# Altium schematic sheet FCC Footprint Charge Controller.SchDoc
size 513 x 386 mm; SheetNumber: 7; SheetTotal: 7
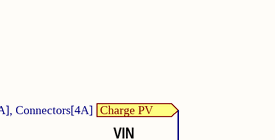
[diagram p0: FCC Footprint Charge Controller.SchDoc, top left]
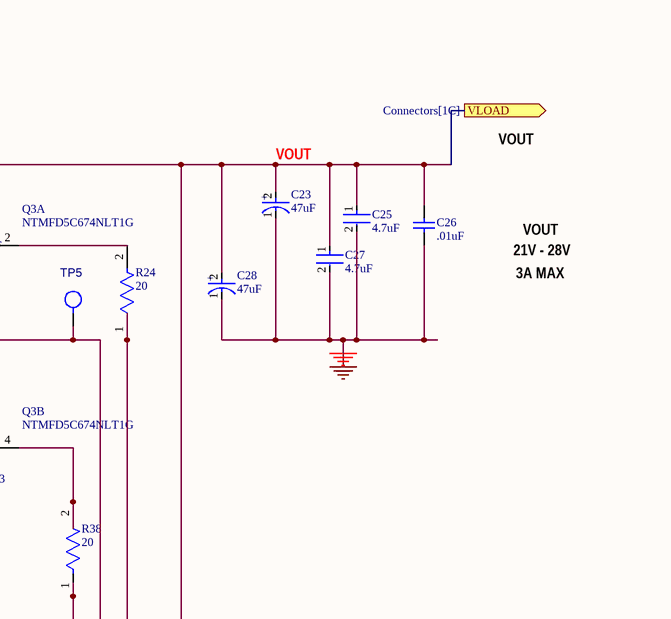
[diagram p1: FCC Footprint Charge Controller.SchDoc, top right]
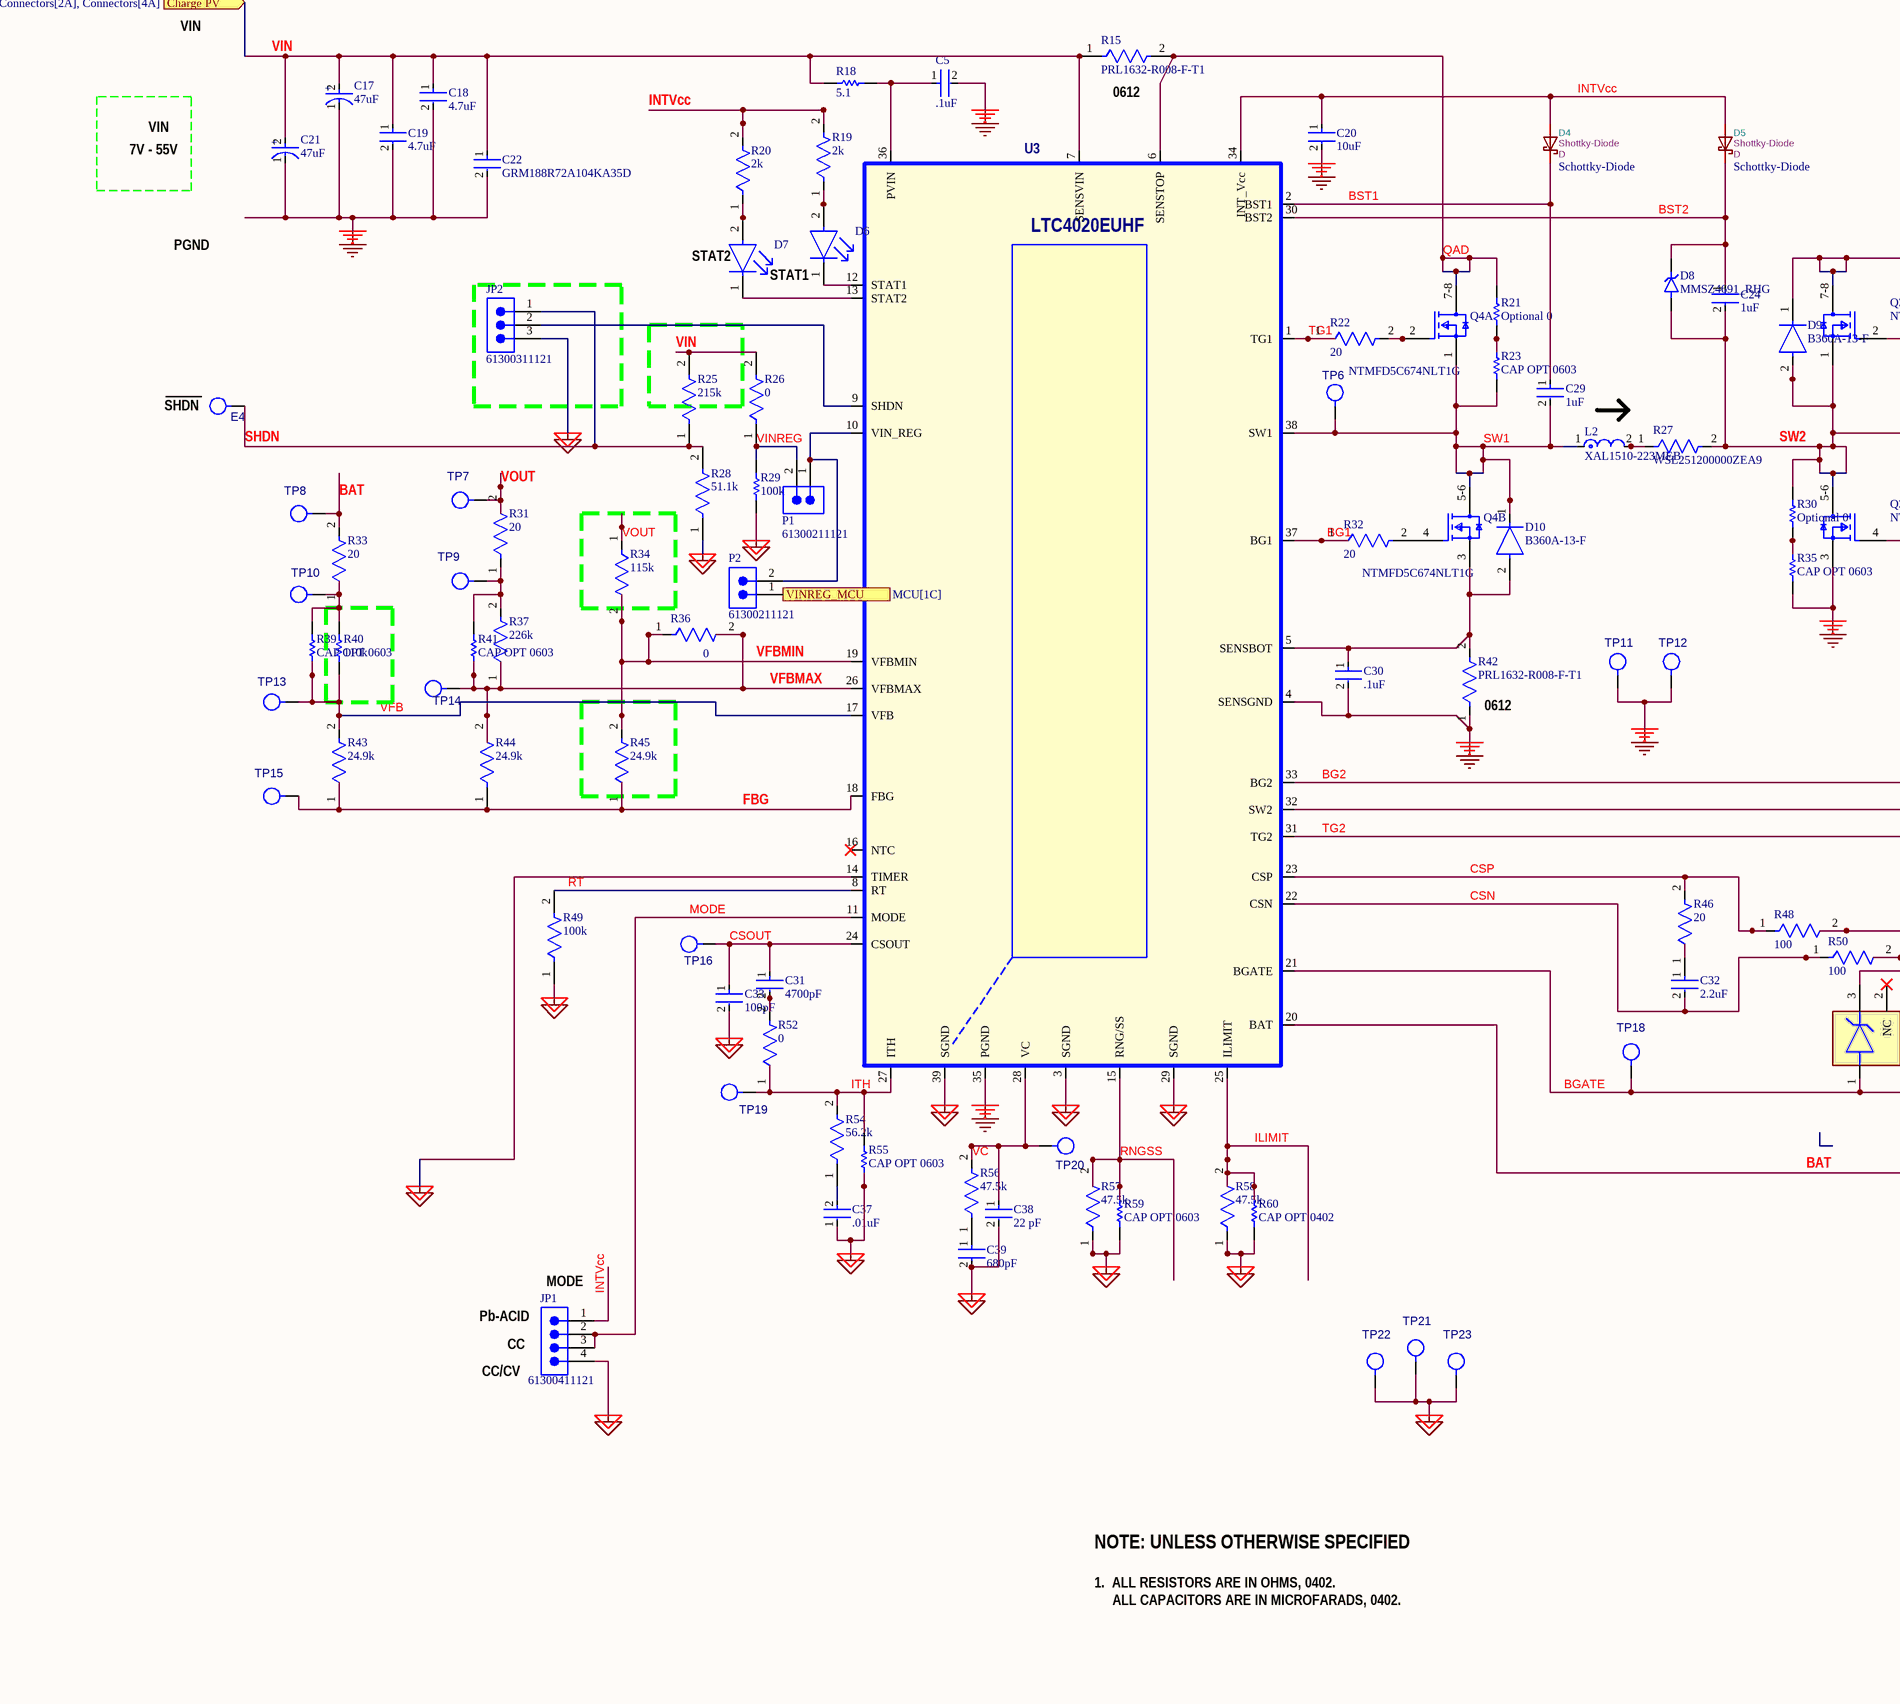
[diagram p2: FCC Footprint Charge Controller.SchDoc, bottom left]
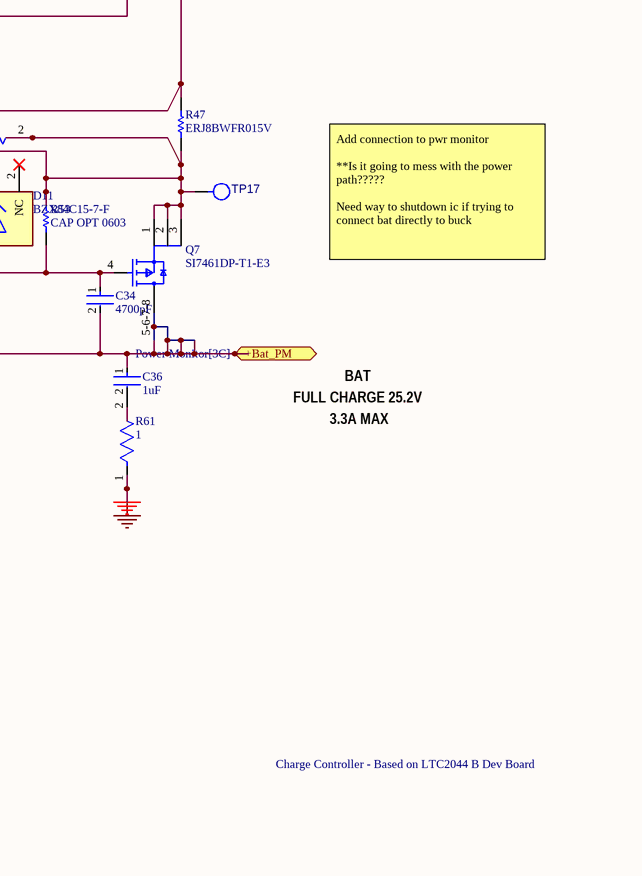
[diagram p3: FCC Footprint Charge Controller.SchDoc, bottom right]

## Parts
C5  .1uF  [FP-GRM188-0_1-e0_2_0_5-IPC_A]
C17  47uF  [FP-FKF-MFG]
C18  4.7uF  [FP-CGA6P-IPC_C]
C19  4.7uF  [FP-CGA6P-IPC_C]
C20  10uF  [FP-CGA4J-IPC_A]
C21  47uF  [FP-FKF-MFG]
C22  GRM188R72A104KA35D  [FP-GRM188-0_1-e0_2_0_5-IPC_B]
C23  47uF  [FP-FKF-MFG]
C24  1uF  [FP-C0603C-CJ-MFG]
C25  4.7uF  [FP-CGA6P-IPC_C]
C26  .01uF  [CAPC1608X92X38NL15T08]
C27  4.7uF  [FP-CGA6P-IPC_C]
C28  47uF  [FP-FKF-MFG]
C29  1uF  [FP-C0603C-CJ-MFG]
C30  .1uF  [FP-GCM155-0_05-IPC_A]
C31  4700pF  [FP-GRM155-0_05-IPC_B]
C32  2.2uF  [FP-GRM188-0_1-e0_2_0_5-IPC_A]
C33  100pF  [FP-C0402-BB-MFG]
C34  4700pF  [FP-GRM155-0_05-IPC_B]
C36  1uF  [FP-GCJ31C-0_3-IPC_A]
C37  .01uF  [FP-GCJ188-0_2-IPC_A]
C38  22 pF  [FP-C0603C-CF-MFG]
C39  680pF  [FP-C0603C-CF-MFG]
D4  Schottky-Diode  value Shottky-Diode  Reference: D  [SOD-123]
D5  Schottky-Diode  value Shottky-Diode  Reference: D  [SOD-123]
D6  (no value)  [FP-APT1608MGC-MFG]
D7  (no value)  [FP-APTD1608SURCK-MFG]
D8  MMSZ4691_RHG  [DIO_MMSZ4691_RHG]
D9  B360A-13-F  [FP-SMA-MFG]
D10  B360A-13-F  [FP-SMA-MFG]
D11  BZX84C15-7-F  [FP-SOT23-MFG]
E4  TEST POINT  [MILLMAX2308]  (value not drawn)
JP1  61300411121  [61300411121]
JP2  61300311121  [61300311121]
L2  XAL1510-223MEB  [FP-XAL1510-223MEB-MFG]
P1  61300211121  [61300211121]
P2  61300211121  [61300211121]
Q3  NTMFD5C674NLT1G  [FP-506BT-MFG]  (parts A,B of 2)
Q4  NTMFD5C674NLT1G  [FP-506BT-MFG]  (parts A,B of 2)
Q7  SI7461DP-T1-E3  [FP-S17-0173-SINGLE-MFG]
R15  PRL1632-R008-F-T1  [FP-PRL1632-MFG]
R18  5.1  [RESC2013X50X30LL20T20]
R19  2k  [FP-CRCW0402-e3-IPC_A]
R20  2k  [FP-CRCW0402-e3-IPC_A]
R21  Optional 0  [RESC2013X50X30LL20T20]
R22  20  [FP-CRCW0402-C-e3-MFG]
R23  CAP OPT 0603  [RESC1608X55X25ML10T15]
R24  20  [FP-CRCW0402-C-e3-MFG]
R25  215k  [FP-CRCW0402-e3-MFG]
R26  0  [FP-RC0402-0_4-MFG]
R27  WSL251200000ZEA9  [FP-WSL2512-MFG]
R28  51.1k  [FP-RC_L0402-MFG]
R29  100k  [RESC1005X40X25NL10T10]
R30  Optional 0  [RESC2013X50X30LL20T20]
R31  20  [FP-AC0603-MFG]
R32  20  [FP-CRCW0402-C-e3-MFG]
R33  20  [FP-AC0603-MFG]
R34  115k  [FP-RC1608-IPC_A]
R35  CAP OPT 0603  [RESC1608X55X25ML10T15]
R36  0  [FP-CRCW0402-e3-IPC_C]
R37  226k  [FP-CRCW0603-e3-IPC_C]
R38  20  [FP-CRCW0402-C-e3-MFG]
R39  CAP OPT 0603  [RESC1608X55X25ML10T15]
R40  110k  [RESC1608X55X30NL20T20]
R41  CAP OPT 0603  [RESC1608X55X25ML10T15]
R42  PRL1632-R008-F-T1  [FP-PRL1632-MFG]
R43  24.9k  [FP-CRCW0603-e3-IPC_B]
R44  24.9k  [FP-CRCW0603-e3-IPC_B]
R45  24.9k  [FP-CRCW0603-e3-IPC_B]
R46  20  [FP-CRCW0402-C-e3-MFG]
R47  ERJ8BWFR015V  [RESC3216X70X50NL05T20]
R48  100  [FP-RT0402-0_35-IPC_C]
R49  100k  [FP-RT0402-MFG]
R50  100  [FP-RT0402-0_35-IPC_C]
R52  0  [FP-CRCW0402-e3-IPC_C]
R53  CAP OPT 0603  [RESC1608X55X25ML10T15]
R54  56.2k  [FP-CR0603-IPC_C]
R55  CAP OPT 0603  [RESC1608X55X25ML10T15]
R56  47.5k  [FP-RMCF0603-IPC_C]
R57  47.5k  [FP-RMCF0603-IPC_C]
R58  47.5k  [FP-RMCF0603-IPC_C]
R59  CAP OPT 0603  [RESC1608X55X25ML10T15]
R60  CAP OPT 0402  [RESC1005X40X25LL05T05]
R61  1  [FP-CRCW0805-e3-IPC_A]
TP5  TEST PAD  [PADSTYLE1]  (value not drawn)
TP6  TEST PAD  [PADSTYLE1]  (value not drawn)
TP7  TEST PAD  [PADSTYLE1]  (value not drawn)
TP8  TEST PAD  [PADSTYLE1]  (value not drawn)
TP9  TEST PAD  [PADSTYLE1]  (value not drawn)
TP10  TEST PAD  [PADSTYLE1]  (value not drawn)
TP11  TEST PAD  [PADSTYLE1]  (value not drawn)
TP12  TEST PAD  [PADSTYLE1]  (value not drawn)
TP13  TEST PAD  [PADSTYLE1]  (value not drawn)
TP14  TEST PAD  [PADSTYLE1]  (value not drawn)
TP15  TEST PAD  [PADSTYLE1]  (value not drawn)
TP16  TEST PAD  [PADSTYLE1]  (value not drawn)
TP17  TEST PAD  [PADSTYLE1]  (value not drawn)
TP18  TEST PAD  [PADSTYLE1]  (value not drawn)
TP19  TEST PAD  [PADSTYLE1]  (value not drawn)
TP20  TEST PAD  [PADSTYLE1]  (value not drawn)
TP21  TEST PAD  [PADSTYLE1]  (value not drawn)
TP22  TEST PAD  [PADSTYLE1]  (value not drawn)
TP23  TEST PAD  [PADSTYLE1]  (value not drawn)
U3  LTC4020EUHF  [FP-UHF-38-05-08-1701-IPC_A]

## Ports
+Bat_PM (bidir, see Power Monitor[3C]), Charge PV (in, see Connectors[1D], Connectors[2A], Connectors[4A]), VINREG_MCU (in, see MCU[1C]), VLOAD (out, see Connectors[1C])

## Nets
GND: C5.2 C17.1(C) C18.2 C19.2 C20.2 C21.1(C) C22.2 C23.1(C) C25.2 C26.1 C27.2 C28.1(C) C30.2 Q3.3(S2) R35.1 R42.1 R61.1 TP11.1 TP12.1 U3.4(SENSGND) U3.35(PGND)
GND_SIGNAL: C33.2 C37.1 C38.2 C39.2 JP1.4 JP2.3 R28.1 R29.2 R49.1 R55.1 R57.1 R58.1 R59.1 R60.1 TP21.1 TP22.1 TP23.1 U3.3(SGND) U3.14(TIMER) U3.29(SGND) U3.39(SGND)
BAT: C34.2 C36.1 Q7.5-6-7-8(D) R33.2 TP8.1 U3.20(BAT) ; port +Bat_PM
BG1: R32.1 U3.37(BG1)
BG2: R38.1 U3.33(BG2)
BGATE: C34.1 D11.1(A) Q7.4(G) R53.1 TP18.1 U3.21(BGATE)
BST1: C29.1 D4.K U3.2(BST1)
BST2: C24.1 D5.K D8.C(K) U3.30(BST2)
CSN: C32.2 R50.1 U3.22(CSN)
CSOUT: C31.1 C33.1 TP16.1 U3.24(CSOUT)
CSP: R46.2 R48.1 U3.23(CSP)
FBG: R43.1 R44.1 R45.1 TP15.1 U3.18(FBG)
ILIMIT: R58.2 R60.2 U3.25(ILIMIT)
INTVcc: C20.1 D4.A D5.A JP1.1 R19.2 R20.2 U3.34(INT_Vcc)
ITH: R52.1 R54.2 R55.2 TP19.1 U3.27(ITH)
MODE: JP1.2 JP1.3 U3.11(MODE)
QAD: Q4.7-8(D1) R15.2 R21.2 U3.6(SENSTOP)
RNGSS: R57.2 R59.2 U3.15(RNG/SS)
RT: R49.2 U3.8(RT)
SHDN: E4.1(A) JP2.1 R25.1 R28.2
SW1: C29.2 D10.1(C) L2.1 Q4.1(S1) Q4.5-6(D2) R23.1 TP6.1 U3.38(SW1)
SW2: C24.2 D8.A D9.2(A) Q3.1(S1) Q3.5-6(D2) R27.2 R30.2 TP5.1 U3.32(SW2)
TG1: R22.1 U3.1(TG1)
TG2: R24.1 U3.31(TG2)
VC: C38.1 R56.2 TP20.1 U3.28(VC)
VFB: R39.1 R40.1 R43.2 TP13.1 U3.17(VFB)
VFBMAX: R36.2 R37.1 R41.1 R44.2 TP14.1 U3.26(VFBMAX)
VFBMIN: R34.2 R36.1 R45.2 U3.19(VFBMIN)
VIN: C17.2(A) C18.1 C19.1 C21.2(A) C22.1 R15.1 R18.1 R25.2 R26.2 U3.7(SENSVIN) ; port Charge PV
VINREG: P1.2 R26.1 R29.1
VINREG_MCU: P2.1 ; port VINREG_MCU
VOUT: C23.2(A) C25.1 C26.2 C27.1 C28.2(A) D9.1(C) Q3.7-8(D1) R31.2 R34.1 R47.2 R48.2 TP7.1 ; port VLOAD
NetC5_1: C5.1 R18.2 U3.36(PVIN)
NetC30_1: C30.1 D10.2(A) Q4.3(S2) R42.2 U3.5(SENSBOT)
NetC31_2: C31.2 R52.2
NetC32_1: C32.1 R46.1
NetC36_2: C36.2 R61.2
NetC37_2: C37.2 R54.1
NetC39_1: C39.1 R56.1
NetD6_1: D6.1(C) U3.12(STAT1)
NetD6_2: D6.2(A) R19.1
NetD7_1: D7.1(C) U3.13(STAT2)
NetD7_2: D7.2(A) R20.1
NetD11_3: D11.3(C) Q7.1(S) Q7.2(S) Q7.3(S) R47.1 R50.2 R53.2 TP17.1
NetJP2_2: JP2.2 U3.9(SHDN)
NetL2_2: L2.2 R27.1
NetP1_1: P1.1 P2.2 U3.10(VIN_REG)
NetQ3_2: Q3.2(G1) R24.2
NetQ3_4: Q3.4(G2) R38.2
NetQ4_2: Q4.2(G1) R22.2
NetQ4_4: Q4.4(G2) R32.2
NetR21_1: R21.1 R23.2
NetR30_1: R30.1 R35.2
NetR31_1: R31.1 R37.2 R41.2 TP9.1
NetR33_1: R33.1 R39.2 R40.2 TP10.1

Not connected (* = marked no-connect by the designer): D11 2(NC)*; U3 16(NTC)*

## Notes on the sheet
- VIN
- (near R15) 0612
- 7V - 55V
- VOUT
- PGND
- (near D7) STAT2
- STAT1
- 21V - 28V
- 3A MAX
- (near E4) SHDN
- (near R42) 0612
- Add connection to pwr monitor
  **Is it going to mess with the power path?????
  Need way to shutdown ic if trying to connect bat directly to buck
- FULL CHARGE 25.2V
- 3.3A MAX
- BAT
- (near JP1) Pb-ACID
- (near JP1) MODE
- (near JP1) CC/CV
- (near JP1) CC
- NOTE: UNLESS OTHERWISE SPECIFIED
- Charge Controller - Based on LTC2044 B Dev Board
- 1.  ALL RESISTORS ARE IN OHMS, 0402.
  ALL CAPACITORS ARE IN MICROFARADS, 0402.
- (in symbol CMP-2000-06210-2) +

## Library data of the parts
C5 = CMP-2006-02945-2: Chip Multilayer Ceramic Capacitors for General Purpose, 0603, 0.10uF, X7R, 15%, 10%, 100V; Capacitance: 100nF; Package Quantity: 10000; Dielectric: X7R; Voltage Rating: 100V; Tolerance: 10%; Case Code (Metric): 1608; Min Operating Temperature: -55°C; Voltage Rating (DC): 100V; Width: 0.031inch; Mount: Surface Mount; Case/Package: 0603; Lead Free: Lead Free; Case Code (Imperial): 0603; Max Operating Temperature: 125°C; Depth: 0.8mm; Length: 1.6mm; Termination: SMD/SMT; Height: 0.8mm; Packaging: Tape and Reel; Thickness: 0.035inch; Radiation Hardening: No
C17 C21 C23 C28 = CMP-2000-06210-2: CAP ALUM 47UF 20% 63V SMD; ESR (Equivalent Series Resistance): 650mR; Material: Aluminium; Polarity: Polar; Ripple Current (AC): 250mA; Life (Hours): 2000Hour; Leakage Current: 3uA; Radiation Hardening: No; RoHS Compliant: Yes; Diameter: 8mm; Case/Package: Radial; Package Quantity: 500; Tolerance: 20%; Capacitance: 47uF; Height: 10.2mm; Dielectric Material: Aluminium; Voltage Rating (DC): 63V; Impedance: 650mR; Width: 10mm; Contact Plating: Tin; Lead Free: Lead Free; Height - Seated (Max): 0.413inch; Voltage Rating: 63V; Construction: Cylindrical; Termination: SMD/SMT; Series: FK; Max Operating Temperature: 105°C; Min Operating Temperature: -55°C; Voltage: 63V; REACH SVHC: No SVHC; Length: 10.2mm; Mount: Surface Mount; Ripple Current: 250mA; Packaging: Tape and Reel
C18 C19 C25 C27 = CMP-2000-07583-2: Cap Ceramic 4.7uF 100V X7S 10% Pad SMD 1210 +125°C Automotive T/R; Capacitance: 4.7uF; Min Operating Temperature: -55°C; Case Code (Imperial): 1210; Tolerance: 10%; Packaging: Tape and Reel; Max Operating Temperature: 125°C; Height: 2mm; Voltage Rating: 100V; Mount: Surface Mount; Dielectric: X7S; Depth: 2.5mm; Weight: 0.000564oz; Case Code (Metric): 3225; Length: 3.2mm; Ratings: AEC-Q200; Termination: SMD/SMT; Case/Package: 1210; Width: 0.098inch; Lead Free: Lead Free; REACH SVHC: No SVHC; Radiation Hardening: No; Package Quantity: 1; Composition: Ceramic; Voltage Rating (DC): 100V; Thickness: 0.087inch
C20 = CMP-08246-000381-1: Cap Ceramic 10uF 25V X7S 10% Pad SMD 0805 +125°C Automotive T/R
C22 = CMP-1035-02595-8: Chip Multilayer Ceramic Capacitors for General Purpose, 0603, 0.10uF, X7R, 15%, 10%, 100V; Capacitance: 100nF; Voltage Rating (DC): 100V; Material: Ceramic; Packaging: Tape and Reel; Dielectric: X7R; Case Code (Imperial): 0603; Package Quantity: 1; Height: 0.8mm; Weight: 0.000222oz; Min Operating Temperature: -55°C; Depth: 0.8mm; Mount: Surface Mount; Thickness: 0.035inch; Voltage: 100V; REACH SVHC: No SVHC; Case/Package: 0603; Voltage Rating: 100V; Width: 0.8mm; Tolerance: 10%; Lead Free: Lead Free; Case Code (Metric): 1608; Radiation Hardening: No; Max Operating Temperature: 125°C; Termination: SMD/SMT; Length: 1.6mm
C24 C29 = CMP-03020-014193-1: CAP CER 0603 1UF 16V X7R 10%; Manufacturer: KEMET; Manufacturer Part Number: C0603C105K4RACAUTO; Temperature Coefficient: 15%; Automotive Grade: Grade 1; Material: Ceramic; Digikey Description: CAP CER 0603 1UF 16V X7R 10%; Octopart: https://octopart.com/c0603c105k4racauto-kemet-91328491; Package: C0603C-CJ; ComponentLink2Description: Datasheet; Mouser Description: Cap Ceramic 1uF 16V X7R 10% Pad SMD 0603 125C Automotive T/R; Automotive: Yes; Tolerance: 10%; Lead Free: Yes; Temperature: -55°C to +125°C; ComponentLink2URL: https://content.kemet.com/datasheets/KEM_C1023_X7R_AUTO_SMD.pdf; Temperature Range Low: -55°C; Ipc Land Pattern Name: CAPC16080X80; Device Class L1: Passive Components; Temperature Characteristic: X7R; Device Class L2: Capacitors; Height: 0.95mm; Device Class L3: Ceramic Capacitors; RoHS: TRUE; Category: Cap; Capacitance: 1uF; Temperature Range High: +125°C; Value: 1uF; Voltage Rating: 16V
C26 = CMP-2006-01966-1: Part Number: VJ0603Y103JXBAT; Manufacturer: Vishay
C30 = CMP-2008-03712-2: Ceramic Capacitor for Automotive 100nF ±10% 16VDC X7R 0402 Paper T/R; Voltage Rating: 16V; Height: 0.5mm; Width: 0.5mm; Packaging: Tape and Reel; Case Code (Imperial): 0402; Package Quantity: 1; Radiation Hardening: No; Voltage Rating (DC): 16V; Capacitance: 100nF; Tolerance: 10%; Thickness: 0.022inch; Max Operating Temperature: 125°C; Depth: 0.5mm; Ratings: AEC-Q200; Termination: SMD/SMT; Case Code (Metric): 1005; Min Operating Temperature: -55°C; Dielectric: X7R; Length: 1mm; Case/Package: 0402; Lead Free: Lead Free; Mount: Surface Mount
C31 C34 = CMP-2008-04663-5: Chip Multilayer Ceramic Capacitors for General Purpose, 0402, 4700pF, X7R, 15%, 10%, 50V; Capacitance: 4.7nF; Voltage: 50V; Case/Package: 0402; Termination: SMD/SMT; Case Code (Metric): 1005; Height: 0.5mm; Voltage Rating: 50V; Packaging: Tape and Reel; Width: 0.02inch; Voltage Rating (DC): 50V; Max Operating Temperature: 125°C; Min Operating Temperature: -55°C; Case Code (Imperial): 0402; Material: Ceramic; Lead Free: Lead Free; Length: 1mm; Package Quantity: 1; Thickness: 0.022inch; Dielectric: X7R; Radiation Hardening: No; Depth: 0.5mm; Mount: Surface Mount; Tolerance: 10%; REACH SVHC: No SVHC
C32 = CMP-2006-02837-2: Chip Multilayer Ceramic Capacitors for General Purpose, 0603, 2.2uF, X7R, 15%, 10%, 10V; Voltage Rating: 10V; Termination: SMD/SMT; Mount: Surface Mount; Case Code (Metric): 1608; Capacitance: 2.2uF; Package Quantity: 10000; Max Operating Temperature: 125°C; Case Code (Imperial): 0603; Min Operating Temperature: -55°C; Dielectric: X7R; Width: 0.031inch; Packaging: Tape and Reel; Tolerance: 10%; Voltage Rating (DC): 10V; Height: 0.8mm; Length: 1.6mm; Radiation Hardening: No; Depth: 0.8mm; Case/Package: 0603; Thickness: 0.035inch
C33 = CMP-2008-03284-2: CAP CER 100PF 50V C0G/NP0 0402; Manufacturer: Kemet; Manufacturer Part Number: C0402C101J5GACTU; Tolerance: 0.05; Temperature Characteristic: C0G; Temperature Coefficient: 15%; Material: Ceramic; Digikey Description: CAP CER 100PF 50V C0G/NP0 0402; Lead Free: Yes; Capacitance: 100 pF; Device Class L3: Ceramic Capacitors; Mouser Description: Multilayer Ceramic Capacitors MLCC - SMD/SMT 50volts 100pF C0G 5%; Octopart: https://octopart.com/c0402c101j5gactu-kemet-132471; Temperature Range Low: -55°C; Value: 100 pF; Automotive: No; Height: 0.55mm; Category: Cap; ComponentLink2URL: https://content.kemet.com/datasheets/KEM_C1002_X7R_SMD.pdf; RoHS: TRUE; Ipc Land Pattern Name: CAPC10050X50; Temperature Range High: +125°C; Device Class L2: Capacitors; Package: C0402-BB; ComponentLink2Description: Datasheet; Temperature: -55°C to +125°C; Voltage Rating: 50 V; Device Class L1: Passive Components
C36 = CMP-06035-000760-1: Cap Ceramic 1uF 100V X7R 10% Pad SMD 1206 Soft Termination  +125°C Automotive T/R; Max Operating Temperature: 125°C; Capacitance: 1uF; Voltage Rating: 100V; Tolerance: 10%; Packaging: Tape and Reel; Ratings: AEC-Q200; Min Operating Temperature: -55°C; Mount: Surface Mount; Features: Soft Termination; Case/Package: 1206
C37 = CMP-2006-02222-2: Cap Ceramic 10000pF 50V X7R 10% Pad SMD 0603 Soft Termination +125°C Automotive T/R; Capacitance: 10nF; Mount: Surface Mount; Case Code (Metric): 1608; Case/Package: 0603; Termination: SMD/SMT; Width: 0.031inch; Length: 0.063inch; Min Operating Temperature: -55°C; Voltage Rating: 50V; Radiation Hardening: No; Lead Free: Lead Free; Packaging: Tape and Reel; Ratings: AEC-Q200; Dielectric: X7R; Voltage Rating (DC): 50V; Thickness: 0.031inch; Depth: 0.8mm; Case Code (Imperial): 0603; Package Quantity: 4000; Max Operating Temperature: 125°C; Tolerance: 10%; Features: Soft Termination
C38 = CMP-2006-03121-2: CAP CER 22PF 25V 10% NP0 0603; Manufacturer Part Number: C0603C220K3GACTU; Manufacturer: KEMET; Material: Ceramic; Tolerance: 0.1; Temperature Coefficient: 30ppm/°C; Temperature Characteristic: C0G; Automotive Grade: Grade 1; Device Class L1: Passive Components; Height: 0.87mm; Value: 22 pF; Temperature: -55°C to +125°C; Octopart: https://octopart.com/c0603c220k3gactu-kemet-9139809; Device Class L3: Ceramic Capacitors; Voltage Rating: 25 V; Capacitance: 22 pF; Temperature Range Low: -55°C; Digikey Description: CAP CER 22PF 25V 10% NP0 0603; Mouser Description: Multilayer Ceramic Capacitors MLCC - SMD/SMT 25volts 22pF C0G 10%; Temperature Range High: +125°C; Automotive: Yes; ComponentLink2Description: Datasheet; Package: C0603C-CF; Device Class L2: Capacitors; Category: Cap; RoHS: TRUE; Lead Free: Yes; ComponentLink2URL: https://api.kemet.com/component-edge/download/datasheet/C0603C100J5GACAUTO.pdf
C39 = CMP-2006-03255-2: CAP CER 680PF 25V 5% NP0 0603; Manufacturer Part Number: C0603C681J3GACTU; Manufacturer: KEMET; Temperature Characteristic: C0G; Automotive Grade: Grade 1; Tolerance: 0.05; Material: Ceramic; Temperature Coefficient: 30ppm/°C; Digikey Description: CAP CER 680PF 25V 5% NP0 0603; Capacitance: 680 pF; Temperature: -55°C to +125°C; Device Class L1: Passive Components; RoHS: TRUE; Device Class L2: Capacitors; Lead Free: Yes; Device Class L3: Ceramic Capacitors; ComponentLink2Description: Datasheet; Mouser Description: 0603 C 680pF Ceramic Multilayer Capacitor; 25 VDC; +125degC; C0G Dielec; +/-5%; Voltage Rating: 25 V; Octopart: https://octopart.com/c0603c681j3gactu-kemet-9143775; Package: C0603C-CF; Category: Cap; Temperature Range High: +125°C; Temperature Range Low: -55°C; Value: 680 pF; Height: 0.87mm; ComponentLink2URL: https://api.kemet.com/component-edge/download/datasheet/C0603C100J5GACAUTO.pdf; Automotive: Yes
D4 D5 = Schottky-Diode: ki_description: Schottky Diode; Datasheet: https://diotec.com/de/produktliste/SBD.html; ki_keywords: Schottky
D6 = CMP-44529-000027-1: LED GREEN CLEAR CHIP SMD; Forward Voltage: 2.1V; Dominant Wavelength: 570nm; Viewing Angle: 120°; Forward Current: 20mA; Luminous Intensity: 70mcd; Max Operating Temperature: 85°C; Case Code (Imperial): 0603; Lens Style: Clear; Height: 0.75mm; Package Quantity: 2000; Width: 0.8mm; Case Code (Metric): 1608; Lead Free: Lead Free; Mount: Surface Mount; Length: 1.6mm; Illumination Color: Green; Min Operating Temperature: -40°C; Test Current: 20mA; Lens Color: Clear; Color: Green; Packaging: Tape and Reel; Case/Package: 0603
D7 = CMP-44529-000034-1: LED RED CLEAR CHIP SMD; Viewing Angle: 60°; Forward Current: 20mA; Forward Voltage: 1.95V; Luminous Intensity: 700mcd; Dominant Wavelength: 630nm; Color: Red; Height: 0.95mm; Illumination Color: Red; Package Quantity: 2000; Case/Package: 0603; Mount: Surface Mount; Length: 1.6mm; Width: 0.8mm; Min Operating Temperature: -40°C; Case Code (Imperial): 0603; Packaging: Tape and Reel; Lens Style: Clear; Case Code (Metric): 1608; Lead Free: Lead Free; Max Operating Temperature: 85°C; Test Current: 20mA
D8 = MMSZ4691_RHG: 500mW, Surface Mount Zener Diode; MF: Taiwan Semiconductor; MP: MMSZ4691 RHG; SnapEDA_Link: https://www.snapeda.com/parts/MMSZ4691%20RHG/Taiwan+Semiconductor/view-part/?ref=snap; Package: SOD-123-2 Taiwan Semiconductor; Value: *; Check_prices: https://www.snapeda.com/parts/MMSZ4691%20RHG/Taiwan+Semiconductor/view-part/?ref=eda
D9 D10 = CMP-2000-05898-2: DIODE SCHOTTKY 60V 3A SMA; Max Forward Surge Current (Ifsm): 80A; Forward Voltage: 700mV; Peak Reverse Current: 500uA; Element Configuration: Single; Capacitance: 250pF; Polarity: Standard; REACH SVHC: No SVHC; Case/Package: SMA; Average Rectified Current: 3A; Radiation Hardening: No; Output Current: 3A; Termination: SMD/SMT; Max Repetitive Reverse Voltage (Vrrm): 60V; Height: 2.3mm; Voltage Rating (DC): 60V; Weight: 0.002258oz; Min Operating Temperature: -55°C; Max Reverse Voltage (DC): 60V; Packaging: Tape and Reel; Width: 2.92mm; Forward Current: 3A; Max Operating Temperature: 150°C; Length: 4.6mm; Number of Pins: 2; Mount: Surface Mount; Lead Free: Lead Free; Package Quantity: 5000; Contact Plating: Tin; Peak Non-Repetitive Surge Current: 80A; Current Rating: 3A
D11 = CMP-12792-000009-1: DIODE ZENER 15V 300MW SOT23-3; Manufacturer: Diodes Inc.; Standoff Height: 0.013mm; Max Zener Voltage: 15.6V; Zener Impedance: 30Ω; Reverse Voltage: 10.5V; Max Junction Temp: +150°C; Forward Current: 10mA; Max Reverse Leakage Current: 0.1uA; Mouser Description: Zener Diodes 15V 350mW; ComponentLink2Description: Datasheet; Manufacturer Part Number: BZX84C15-7-F; Power Dissipation: 300mW; Temperature: -65°C to +150°C; Automotive: No; Category: Diode; Device Class L2: Diodes; Temperature Range Low: -65°C; Device Class L1: Discrete Semiconductors; Digikey Description: DIODE ZENER 15V 300MW SOT23-3; ComponentLink2URL: https://www.diodes.com/assets/Datasheets/ds18001.pdf; Lead Free: Yes; RoHS: TRUE; Height: 1.1mm; Octopart: https://octopart.com/bzx84c15-7-f-diodes+inc.-327721; Footprint Url: https://www.diodes.com/assets/Package-Files/SOT23.pdf; Temperature Range High: +150°C; Device Class L3: Zener Diodes; Nom Zener Voltage: 15V; Package: SOT23
E4 = TEST_POINT_.156_MILL-MAX_2308: TEST POINT,TURRET,0.064" MTG. HOLE,PCB 0.062" THK; Part Reference: E3; PART_NUMBER: 260-0004; Manufacturer PN: 2308-2-00-80-00-00-07-0; Inventory Qty: 1142083; FPLIST: MILLMAX2308,MILLMAX2308-2; CLASS: IO; Value: TEST POINT; Manufacturer: MILL-MAX; PCB Footprint: MILLMAX2308
JP1 = CMP-1502-01064-3: NexarPartId: 32855522; Operating Supply Voltage: 250V; Pitch: 2.54mm; Contact Resistance: 20mΩ; Number of Positions: 4; Current Rating: 3A; Connector Type: Male Pin; Gender: Male; Contact Plating: Gold; Height: 8.89mm; Lead Pitch: 2.54mm; Lead Free: Lead Free; Contact Mating Length: 5.9944mm; Number of Rows: 1; Termination: Solder; Packaging: Bulk; REACH SVHC: Unknown; Min Operating Temperature: -40°C; RoHS: Compliant; Number of Contacts: 4; Voltage Rating: 250V; Color: Black; Max Operating Temperature: 105°C; Contact Material: Copper; Mount: Through Hole; Orientation: Vertical; Number of Pins: 4
JP2 = CMP-1502-01062-3: NexarPartId: 32855521; Current Rating: 3A; Voltage Rating: 250V; Number of Positions: 3; Pitch: 2.54mm; Contact Resistance: 20mΩ; Connector Type: Male Pin; Gender: Male; REACH SVHC: Unknown; Packaging: Bulk; Contact Material: Copper; Min Operating Temperature: -40°C; Number of Rows: 1; Orientation: Vertical; RoHS: Compliant; Contact Plating: Gold; Max Operating Temperature: 105°C; Mount: Through Hole; Height: 8.94mm; Operating Supply Voltage: 250V; Number of Pins: 3; Contact Mating Length: 5.9944mm; Number of Contacts: 3; Color: Black; Lead Free: Lead Free; Lead Pitch: 2.54mm; Termination: Solder
L2 = CMP-11268-000144-1: Fixed Inductors 22uH Shld 20% 14A 16mOhms AECQ2; Inductance: 22uH; RoHS Compliant: Yes; Packaging: Cut Tape
P1 P2 = CMP-1712-00002-6: NexarPartId: 20081794; Number of Contacts: 2; Pitch: 2.54mm; Connector Type: Male Pin; Voltage Rating: 250V; Current Rating: 3A; Gender: Male; Contact Resistance: 20mΩ; Height: 8.94mm; Lead Free: Lead Free; Number of Pins: 2; Termination: Through Hole; RoHS: Compliant; Lead Pitch: 2.54mm; REACH SVHC: No SVHC; Housing Material: PBT; Contact Mating Length: 5.9944mm; Min Operating Temperature: -40°C; Orientation: Vertical; Contact Material: Copper; Contact Gender: Male; Max Operating Temperature: 125°C; Number of Rows: 1; Number of Positions: 2; Packaging: Bulk; Contact Plating: Gold; Mount: Through Hole; Color: Black; Operating Supply Voltage: 250V
Q3 Q4 = CMP-00278-87920666-1: NTMFD5C674NLT1G Power MOSFET, Dual N-Channel, 60V, 42A, 14.4 mΩ; Manufacturer Lifecycle Status: ACTIVE; Max Junction Temperature (Tj): 175°C; Drain to Source Resistance: 16.4mΩ; Continuous Drain Current (ID): 11A; Turn-On Delay Time: 9.4ns; Power Dissipation: 3W; Turn-Off Delay Time: 18.6ns; Number of Channels: 2; Gate to Source Voltage (Vgs): 20V; Min Operating Temperature: -55°C; Height: 1.1mm; Drain to Source Breakdown Voltage: 60V; RoHS: Compliant; Drain to Source Voltage (Vdss): 60V; Max Operating Temperature: 175°C; NexarPartId: 87920666; Lifecycle Status: Production; Schedule B: 8541290080, 8541290080
Q7 = CMP-02550-000014-1: MOSFET P-CH 60V 8.6A PPAK SO-8; Manufacturer: Vishay; Rthja Max: 52°C/W; Max Forward Diode Voltage: -1.2V; Depletion Mode: False; Max Junction Temp: +150°C; Pulse Drain Current: -60A; Power Dissipation: 1.9W; Transconductance: 31S; Number Of Channels: 1; Gate Charge At Vgs: 121nC @ -10V; Drain To Source Resistance: 0.0115Ω; Threshold Vgs Min: -1V; Turn Off Delay Time: 205ns; Reverse Recovery Time: 45ns; Standoff Height: 0mm; Continuous Drain Current: -8.6A; Typ Forward Diode Voltage: -0.8V; Turn On Delay Time: 20ns; Gate To Source Voltage: 20V; Drain To Source Voltage: -60V; Threshold Vgs Max: -3V; Mouser Description: MOSFET 60V 14.4A 5.4W 14.5mohm @ 10V; Manufacturer Part Number: SI7461DP-T1-E3; RoHS: TRUE; Package: S17-0173-SINGLE; Device Class L3: MOSFETs; ComponentLink2Description: Datasheet; Digikey Description: MOSFET P-CH 60V 8.6A PPAK SO-8; Category: Trans; Lead Free: Yes; Device Class L2: Transistors; Temperature Range High: +150°C; ComponentLink2URL: http://www.vishay.com/docs/72567/si7461dp.pdf; Number Of P Channels: 1; Device Class L1: Discrete Semiconductors; Octopart: https://octopart.com/si7461dp-t1-e3-vishay-42273025; Height: 1.17mm; Temperature Range Low: -55°C; Automotive: No; Temperature: -55°C to +150°C
R15 R42 = CMP-2003-04761-2: 8 mOhms ±1% 1W Chip Resistor Wide 0612 (1632 Metric), Current Sense Thin Film; Temperature Coefficient: 350ppm/°C; Resistance: 8mR; Case/Package: 1206; Package Quantity: 1; Width: 0.126inch; Termination: SMD/SMT; Height: 0.024inch; Resistor Type: Thin Film; Series: PRL; Lead Free: Lead Free; Case Code (Imperial): 1206; Number of Terminations: 2; Max Operating Temperature: 125°C; Case Code (Metric): 3216; Max Power Dissipation: 1W; RoHS Compliant: Yes; Length: 0.063inch; Technology: THIN FILM; Tolerance: 1%; Min Operating Temperature: -55°C; Packaging: Tape and Reel; Power Rating: 1W
R18 = CMP-2001-04034-1: Manufacturer: Vishay Dale; Part Number: CRCW08055M10JNEA
R19 R20 = CMP-2002-08446-2: RES Thick Film, 2kΩ, 1%, 0.063W, 100ppm/°C, 0402; Max Power Dissipation: 63mW; Resistance: 2kR; Voltage Rating: 50V; Contact Plating: Tin; Tolerance: 1%; Weight: 2.3E-05oz; Mount: Surface Mount; Length: 1mm; Case Code (Metric): 1005; Number of Pins: 2; Depth: 0.5mm; Power Rating: 63mW; Packaging: Tape and Reel; Case/Package: 0402; Max Operating Temperature: 155°C; Width: 0.5mm; Package Quantity: 10; Case Code (Imperial): 0402; Features: Automotive AEC-Q200; Number of Terminations: 2; Lead Free: Lead Free; Composition: Thick Film; Termination: SMD/SMT; Min Operating Temperature: -55°C; Radiation Hardening: No; Military Standard: Not; Height: 0.35mm; Voltage Rating (DC): 50V; Temperature Coefficient: 100ppm/°C
R21 R30 = CMP-2001-04896-1: Manufacturer: Vishay Dale; Part Number: CRCW08050000Z0EA
R22 R24 R32 R38 R46 = CMP-02407-000003-1: RES SMD 20 OHM 1% 1/16W 0402; Manufacturer: Vishay; Manufacturer Part Number: CRCW040220R0FKEDC; Temperature Coefficient: 100ppm/°C; Automotive Grade: NA; Power Rating: 0.063W; Resistance: 20Ω; Value: 20Ω; Voltage Rating: 50V; Octopart: https://octopart.com/crcw040220r0fkedc-vishay-75649417; Lead Free: Yes; Device Class L2: Resistors; Device Class L1: Passive Components; Composition: Thick Film; Package: CRCW0402-C-e3; Series: CRCW...C e3; ComponentLink2Description: Datasheet; Category: Res; Ipc Land Pattern Name: RESC10050X30; Temperature Range High: +155°C; Device Class L3: Chip SMD Resistors; ComponentLink2URL: http://www.vishay.com/docs/28773/crcwce3.pdf; Temperature Range Low: -55°C; RoHS: TRUE; Height: 0.35mm; Temperature: -55°C to +155°C; Tolerance: 1%; Mouser Description: Res Thick Film 0402 20 Ohm 1% 0.063W(1/16W) ±100ppm/C Pad SMD T/R; Digikey Description: RES SMD 20 OHM 1% 1/16W 0402; Automotive: No
R23 R35 R39 R41 R53 R55 R59 = CMP-2100-03667-1: Chip Resistor, 0 Ohm, +/- 5%, 0.1 W, -55 to 155 degC, 0603 (1608 Metric), RoHS, Tape and Reel; Manufacturer: Yageo; Temperature Coefficient: 200ppm/degreesC; Voltage Rating: 50V; Power Rating: 100mW; Resistance: 0mOhm; Width: 0.8mm; Max Operating Temperature: 155degC; Tolerance: 5%; Package Reference: 0603; Height: 0.45mm; Depth: 0.8mm; Package Description: 2-Pin Surface Mount Device, Body 1.6 x 0.8 mm; Termination: SMD/SMT; Package Quantity: 5000; Case/Package: 0603; Case Code (Imperial): 0603; Radiation Hardening: No; Number of Pins: 2; Length: 1.6mm; Lead Free: LeadFree; Voltage Rating (DC): 50V; Military Standard: Not; Datasheet URL: http://www.yageo.com/NewPortal/yageodocoutput?fileName=/pdf/R-Chip/PYu-RC_Group_51_RoHS_L_5.pdf; Manufacturer URL: http://www.yageo.com/; Packaging: TapeandReel; Case Code (Metric): 1608; Min Operating Temperature: -55degC; Composition: ThickFilm; RoHSCompliant: true; Contact Plating: Tin; Datasheet Version: Rev. 5, 10/2016; REACH SVHC: NoSVHC
R25 = CMP-2002-08364-2: RES Thick Film, 215kΩ, 1%, 0.063W, 100ppm/°C, 0402; Max Power Dissipation: 63mW; Resistance: 215kR; Voltage Rating: 50V; Number of Terminations: 2; Contact Plating: Tin; Mount: Surface Mount; Features: Automotive AEC-Q200; Weight: 2.3E-05oz; Tolerance: 1%; Packaging: Tape and Reel; Min Operating Temperature: -55°C; Case Code (Imperial): 0402; Width: 0.02inch; Case/Package: 0402; Max Operating Temperature: 155°C; Height: 0.35mm; Depth: 0.5mm; Number of Pins: 2; Power Rating: 63mW; Composition: Thick Film; Termination: SMD/SMT; Military Standard: Not; Temperature Coefficient: 100ppm/°C; Package Quantity: 10; Length: 1mm; Case Code (Metric): 1005
R26 = CMP-03412-037830-1: RES SMD 0 OHM JUMPER 1/16W 0402; Max Power Dissipation: 63mW; Resistance: 0mR; Width: 0.02inch; Height: 0.016inch; Length: 0.039inch; Number of Terminations: 2; Max Operating Temperature: 155°C; Case Code (Metric): 1005; Resistor Type: Thick Film; RoHS Compliant: Yes; Packaging: Tape and Reel; Min Operating Temperature: -55°C; Case/Package: 0402; Features: Moisture Resistant; Case Code (Imperial): 0402
R27 = CMP-02407-013091-1: RES 0 OHM JUMPER 2512; Resistance: 0R; Temperature Coefficient: 275ppm/°C; Power Rating: 1W; Min Operating Temperature: -65°C; Contact Plating: Tin; Case/Package: 2512; Max Operating Temperature: 170°C; Resistor Type: Metal Strip; Case Code (Metric): 6432; RoHS Compliant: Yes; Case Code (Imperial): 2512; Packaging: Cut Tape; Lead Free: Lead Free; Reach SVHC Compliant: Yes; Radiation Hardening: No
R28 = CMP-2002-07730-2: RES SMD 51.1K OHM 1% 1/16W 0402; Manufacturer Part Number: RC0402FR-0751K1L; Manufacturer: Yageo; Value: 51.1kΩ; Voltage Rating: 50V; Power Rating: 0.063W; Temperature Coefficient: 100ppm/°C; Mouser Description: Thick Film Resistors - SMD 51.1K OHM 1%; Octopart: https://octopart.com/rc0402fr-0751k1l-yageo-39800073; Tolerance: 1%; Temperature Range High: +155°C; Automotive: No; Digikey Description: RES SMD 51.1K OHM 1% 1/16W 0402; Temperature Range Low: -55°C; Composition: Thick Film; Category: Res; Device Class L2: Resistors; Package: RC_L0402; Series: RC_L; Resistance: 51.1kΩ; Footprint Url: http://www.yageo.com/exep/pages/download/literatures/PYu-R_Mount_10.pdf; Height: 0.4mm; ComponentLink2URL: http://www.yageo.com/documents/recent/PYu-RC_Group_51_RoHS_L_10.pdf; Device Class L1: Passive Components; RoHS: TRUE; Temperature: -55°C to +155°C; Ipc Land Pattern Name: RESC10050X35; Device Class L3: Chip SMD Resistors; Lead Free: Yes; ComponentLink2Description: Datasheet
R29 = CMP-2002-04696-1: Manufacturer: Bourns; Part Number: CR0402-FX-1003GLF
R31 R33 = CMP-03412-035160-2: RES 20Ω 1.00% 0.1W 0603; Tolerance: 1%; Temperature Coefficient: 100ppm/°C; Voltage Rating: 50V; Max Power Dissipation: 100mW; Resistance: 20R; Case Code (Imperial): 0603; Length: 1.6mm; Case/Package: 0603; Ratings: AEC-Q200; Width: 0.8mm; Resistor Type: Thick Film; Number of Terminations: 2; Termination: SMD/SMT; Height: 0.45mm; Series: AC; RoHS Compliant: Yes; Features: Moisture Resistant; Min Operating Temperature: -55°C; Max Operating Temperature: 155°C; Power Rating: 100mW; Packaging: Tape and Reel; Case Code (Metric): 1608
R34 = CMP-13261-004611-1: Res Thick Film 0603 115kΩ 1% 0.1W ±100ppm/°C Molded SMD T/R; Voltage Rating (DC): 50V; Max Power Dissipation: 100mW; Resistance: 115kR; Radiation Hardening: No; Length: 0.063inch; Temperature Coefficient: 100ppm/°C; Case Code (Imperial): 0603; Power Rating: 100mW; Case Code (Metric): 1608; Composition: Thick Film; Height: 0.022inch; Case/Package: 0603; Lead Free: Lead Free; Tolerance: 1%; Number of Terminations: 2; Max Operating Temperature: 155°C; Features: Moisture Resistant; Contact Plating: Tin; Packaging: Tape and Reel; Package Quantity: 1; Width: 0.031inch; Min Operating Temperature: -55°C
R36 R52 = CMP-2002-08122-2: RES Thick Film, 0Ω, 0.063W, 0402; Tolerance: 5%; Max Power Dissipation: 63mW; Voltage Rating: 50V; Temperature Coefficient: 100ppm/°C; Resistance: 0mR; Contact Plating: Tin; Height: 0.35mm; Radiation Hardening: No; Features: Automotive AEC-Q200; Composition: Thick Film; Width: 0.5mm; Weight: 2.3E-05oz; Termination: SMD/SMT; Packaging: Tape and Reel; Mount: Surface Mount; Case Code (Metric): 1005; Military Standard: Not; Min Operating Temperature: -55°C; Number of Terminations: 2; Package Quantity: 1; Case Code (Imperial): 0402; Depth: 0.5mm; Max Operating Temperature: 155°C; Case/Package: 0402; Power Rating: 63mW; Lead Free: Lead Free; Voltage Rating (DC): 50V; Length: 1mm
R37 = CMP-1012-00774-3: RES Thick Film, 226kΩ, 1%, 0.1W, 100ppm/°C, 0603; Working Voltage: 75V; Resistance: 226kR; Power Rating: 100mW; Number of Pins: 2; Case/Package: 0603; Voltage Rating: 75V; Radiation Hardening: No; Termination: SMD/SMT; Max Operating Temperature: 155°C; Packaging: Tape and Reel; Width: 0.85mm; Height: 0.45mm; Number of Terminations: 2; Contact Plating: Tin; Composition: Thick Film; Case Code (Imperial): 0603; Military Standard: Not; Temperature Coefficient: 100ppm/°C; Depth: 0.85mm; Min Operating Temperature: -55°C; Case Code (Metric): 1608; Lead Free: Lead Free; Voltage Rating (DC): 75V; Weight: 7.1E-05oz; Length: 1.55mm; Package Quantity: 5000; Tolerance: 1%
R40 = CMP-2000-00886-1: Part Number: ERA3AEB114V; Manufacturer: Panasonic
R43-R45 = CMP-2000-03121-2: RES Thick Film, 24.9kΩ, 1%, 0.1W, 100ppm/°C, 0603; Voltage Rating: 75V; Power Rating: 100mW; Resistance: 24.9kR; Case Code (Imperial): 0603; Depth: 0.85mm; Package Quantity: 10; Packaging: Tape and Reel; Weight: 7.1E-05oz; Case Code (Metric): 1608; Military Standard: Not; Height: 0.45mm; Features: Automotive AEC-Q200; Radiation Hardening: No; Max Operating Temperature: 155°C; Max Power Dissipation: 100mW; Mount: Surface Mount; Width: 0.85mm; Composition: Thick Film; Length: 1.55mm; Temperature Coefficient: 100ppm/°C; Case/Package: 0603; Lead Free: Lead Free; Contact Plating: Tin; Voltage Rating (DC): 75V; Tolerance: 1%; Number of Terminations: 2; Min Operating Temperature: -55°C; Termination: SMD/SMT
R47 = CMP-2003-00767-1: Manufacturer: Panasonic; Part Number: ERJ8BWFR015V
R48 R50 = CMP-2002-02912-3: RES SMD 100 OHM 0.1% 1/16W 0402; Power Rating: 62.5mW; Voltage Rating: 50V; Temperature Coefficient: 25ppm/°C; Max Power Dissipation: 63mW; Resistance: 100R; Resistor Type: Thin Film; Case/Package: 0402; Packaging: Tape and Reel; Package Quantity: 10000; Features: Moisture Resistant; RoHS Compliant: Yes; Size Code: 0402; Military Standard: Not; Height: 0.014inch; Series: RT; Number of Terminations: 2; Termination: SMD/SMT; Case Code (Metric): 1005; Max Operating Temperature: 125°C; Weight: 2.3E-05oz; Voltage Rating (DC): 50V; Width: 0.02inch; Contact Plating: Tin; Tolerance: 0.1%; Depth: 0.5mm; Lead Free: Lead Free; Min Operating Temperature: -55°C; Length: 1mm; Construction: Rectangular; Case Code (Imperial): 0402
R49 = CMP-2002-02553-2: RES 100K OHM 1/16W 1% SMD 0402; Manufacturer Part Number: RT0402FRE07100KL; Manufacturer: Yageo; Temperature Coefficient: 50 ppm/°C; Voltage Rating: 50V; Power Rating: 0.063W; Tolerance: 0.01; Resistance: 100KΩ; Value: 100KΩ; Mouser Description: Res Thin Film 0402 100K Ohm 1% 0.063W(1/16W) ???}50ppm/???? Molded SMD Paper T/R; Package: RT0402; Composition: Thin Film; Series: RT; Footprint Url: http://www.yageo.com/exep/pages/download/literatures/PYu-R_Mount_10.pdf; ComponentLink2Description: Datasheet; Digikey Description: RES 100K OHM 1/16W 1% SMD 0402; Device Class L3: Chip SMD Resistors; ComponentLink2URL: http://www.yageo.com/documents/recent/PYu-RT_1-to-0.01_RoHS_L_9.pdf; Lead Free: Yes; Ipc Land Pattern Name: RESC10050X30; Temperature: -55°C to +155°C; Octopart: https://octopart.com/rt0402fre07100kl-yageo-1444458; RoHS: TRUE; Device Class L1: Passive Components; Height: 0.35mm; Temperature Range High: +155°C; Category: Res; Automotive: No; Temperature Range Low: -55°C; Device Class L2: Resistors
R54 = CMP-07231-000535-1: Thick Film Chip Resistors 0603 56.2kΩ 0.1W 1% 100ppm/°C; Power Rating: 100mW; Voltage Rating: 50V; Resistance: 56.2kR; Radiation Hardening: No; Mount: Surface Mount; Case Code (Metric): 1608; Termination: SMD/SMT; Width: 0.8mm; Max Operating Temperature: 155°C; Features: Moisture Resistant; Package Quantity: 1; Contact Plating: Tin; Number of Terminations: 2; Min Operating Temperature: -55°C; Composition: Thick Film; Tolerance: 1%; Case/Package: 0603; Length: 0.063inch; Height: 0.022inch; Max Power Dissipation: 100mW; Case Code (Imperial): 0603; Packaging: Tape and Reel; Temperature Coefficient: 100ppm/°C; Thickness: 457um
R56-R58 = CMP-26527-006032-1: 47.5kΩ ±1% 0.1W 0603 Thick Film Chip Resistor AEC-Q200 compliant; Max Power Dissipation: 100mW; Resistance: 47.5kR; Temperature Coefficient: 100ppm/°C; Tolerance: 1%; Mount: Surface Mount; Construction: Rectangular; Width: 0.031inch; Size Code: 0603; Case/Package: 0603; Max Operating Temperature: 155°C; Lead Free: Lead Free; Case Code (Imperial): 0603; Contact Plating: Tin; Features: Automotive AEC-Q200; Military Standard: Not; Length: 1.55mm; Resistor Type: Thick Film; Packaging: Tape and Reel; Series: RMCF; RoHS Compliant: Yes; Height: 0.022inch; Depth: 0.8mm; Min Operating Temperature: -55°C; Power Rating: 100mW; Case Code (Metric): 1608; Radiation Hardening: No; Number of Terminations: 2
R60 = CMP-2000-07451-1: Chip Resistor, 0 Ohm, 0.1 W, -55 to 155 degC, 0402 (1005 Metric), RoHS, Tape and Reel; Manufacturer: Panasonic; Voltage Rating (DC): 50V; Temperature Coefficient: 600ppm/��C; Max Power Dissipation: 100mW; Resistance: 0mOhm; Tolerance: 5%; Number of Terminations: 2; Mount: SurfaceMount; Height: 0.35mm; Packaging: TapeandReel; Contact Plating: Tin; Manufacturer URL: http://www.panasonic.com/; Composition: ThickFilm; Max Operating Temperature: 155degC; REACH SVHC: NoSVHC; Case/Package: 0402; Package Reference: 402; Depth: 0.5mm; Package Description: 2-Pin Surface Mount Device, Body 1 x 0.5 mm; Datasheet URL: https://industrial.panasonic.com/cdbs/www-data/pdf/RDA0000/AOA0000C301.pdf; RoHSCompliant: True; Case Code (Imperial): 0402; Military Standard: Not; Min Operating Temperature: -55degC; Power Rating: 100mW; Datasheet Version: 03/2015; Length: 1mm; Case Code (Metric): 1005; Termination: SMD/SMT; Mounting Technology: SurfaceMount; Voltage Rating: 50V; Width: 0.02inch; Package Quantity: 1; Lead Free: LeadFree; Radiation Hardening: No
R61 = CMP-2001-03649-2: RES Thick Film, 1Ω, 1%, 0.125W, 100ppm/°C, 0805; Power Rating: 125mW; Resistance: 1R; Voltage Rating: 150V; Number of Terminations: 2; Mount: Surface Mount; Packaging: Tape and Reel; Radiation Hardening: No; Number of Pins: 2; Case Code (Imperial): 0805; Contact Plating: Tin; Military Standard: Not; Min Operating Temperature: -55°C; Case Code (Metric): 2012; Max Operating Temperature: 155°C; Max Power Dissipation: 125mW; Termination: SMD/SMT; Weight: 0.000194oz; Case/Package: 0805; Width: 0.049inch; Temperature Coefficient: 100ppm/°C; Package Quantity: 10; Composition: Thick Film; Tolerance: 1%; Height: 0.02inch; Depth: 1.25mm; Length: 2mm; Features: Automotive AEC-Q200
TP5 = PAD_STYLE_C: TESTPOINT, PCB COPPER FEATURE; Part Reference: TP4; PART_NUMBER: PCBPADS-8; CLASS: IO; Value: TEST PAD; PCB Footprint: PADSTYLE1
TP6 = PAD_STYLE_C: TESTPOINT, PCB COPPER FEATURE; Part Reference: TP3; PART_NUMBER: PCBPADS-8; CLASS: IO; Value: TEST PAD; PCB Footprint: PADSTYLE1
TP7 = PAD_STYLE_C: TESTPOINT, PCB COPPER FEATURE; Part Reference: TP6; PART_NUMBER: PCBPADS-8; CLASS: IO; Value: TEST PAD; PCB Footprint: PADSTYLE1
TP8 = PAD_STYLE_C: TESTPOINT, PCB COPPER FEATURE; Part Reference: TP5; PART_NUMBER: PCBPADS-8; CLASS: IO; Value: TEST PAD; PCB Footprint: PADSTYLE1
TP9 = PAD_STYLE_C: TESTPOINT, PCB COPPER FEATURE; Part Reference: TP10; PART_NUMBER: PCBPADS-8; CLASS: IO; Value: TEST PAD; PCB Footprint: PADSTYLE1
TP10 = PAD_STYLE_C: TESTPOINT, PCB COPPER FEATURE; Part Reference: TP9; PART_NUMBER: PCBPADS-8; CLASS: IO; Value: TEST PAD; PCB Footprint: PADSTYLE1
TP11 = PAD_STYLE_C: TESTPOINT, PCB COPPER FEATURE; Part Reference: TP1; PART_NUMBER: PCBPADS-8; CLASS: IO; Value: TEST PAD; PCB Footprint: PADSTYLE1
TP12 = PAD_STYLE_C: TESTPOINT, PCB COPPER FEATURE; Part Reference: TP2; PART_NUMBER: PCBPADS-8; CLASS: IO; Value: TEST PAD; PCB Footprint: PADSTYLE1
TP13 = PAD_STYLE_C: TESTPOINT, PCB COPPER FEATURE; Part Reference: TP13; PART_NUMBER: PCBPADS-8; CLASS: IO; Value: TEST PAD; PCB Footprint: PADSTYLE1
TP14 = PAD_STYLE_C: TESTPOINT, PCB COPPER FEATURE; Part Reference: TP12; PART_NUMBER: PCBPADS-8; CLASS: IO; Value: TEST PAD; PCB Footprint: PADSTYLE1
TP15 = PAD_STYLE_C: TESTPOINT, PCB COPPER FEATURE; Part Reference: TP14; PART_NUMBER: PCBPADS-8; CLASS: IO; Value: TEST PAD; PCB Footprint: PADSTYLE1
TP16 = PAD_STYLE_C: TESTPOINT, PCB COPPER FEATURE; Part Reference: TP15; PART_NUMBER: PCBPADS-8; CLASS: IO; Value: TEST PAD; PCB Footprint: PADSTYLE1
TP17 = PAD_STYLE_C: TESTPOINT, PCB COPPER FEATURE; Part Reference: TP16; PART_NUMBER: PCBPADS-8; CLASS: IO; Value: TEST PAD; PCB Footprint: PADSTYLE1
TP18 = PAD_STYLE_C: TESTPOINT, PCB COPPER FEATURE; Part Reference: TP17; PART_NUMBER: PCBPADS-8; CLASS: IO; Value: TEST PAD; PCB Footprint: PADSTYLE1
TP19 = PAD_STYLE_C: TESTPOINT, PCB COPPER FEATURE; Part Reference: TP18; PART_NUMBER: PCBPADS-8; CLASS: IO; Value: TEST PAD; PCB Footprint: PADSTYLE1
TP20 = PAD_STYLE_C: TESTPOINT, PCB COPPER FEATURE; Part Reference: TP19; PART_NUMBER: PCBPADS-8; CLASS: IO; Value: TEST PAD; PCB Footprint: PADSTYLE1
TP21 = PAD_STYLE_C: TESTPOINT, PCB COPPER FEATURE; Part Reference: TP21; PART_NUMBER: PCBPADS-8; CLASS: IO; Value: TEST PAD; PCB Footprint: PADSTYLE1
TP22 = PAD_STYLE_C: TESTPOINT, PCB COPPER FEATURE; Part Reference: TP20; PART_NUMBER: PCBPADS-8; CLASS: IO; Value: TEST PAD; PCB Footprint: PADSTYLE1
TP23 = PAD_STYLE_C: TESTPOINT, PCB COPPER FEATURE; Part Reference: TP22; PART_NUMBER: PCBPADS-8; CLASS: IO; Value: TEST PAD; PCB Footprint: PADSTYLE1
U3 = LTC4020EUHF: IC,55V BUCK-BOOST BATTERY CHARGER,38-pin QFN; Part Reference: U1; Manufacturer PN: LTC4020EUHF#PBF; Manufacturer: LINEAR TECH.; EDMVersionID: 819358601; Inventory Qty: 0; PCB Footprint: LTC-UHF-38-1701; Value: LTC4020EUHF; Package Type: 38-pin QFN; CLASS: IC; Package Size: QFN-38; PART_NUMBER: LTC4020EUHF#PBF